# Altium schematic sheet Project_Overview.SchDoc
size A4; Organization: Arribada Initiative; Address1: https://github.com/arribada; Address2: contact@arribada.org; Address3: arribada.org; Address4: UK - Portsmouth; DocumentNumber: 1; SheetNumber: 1; SheetTotal: 3
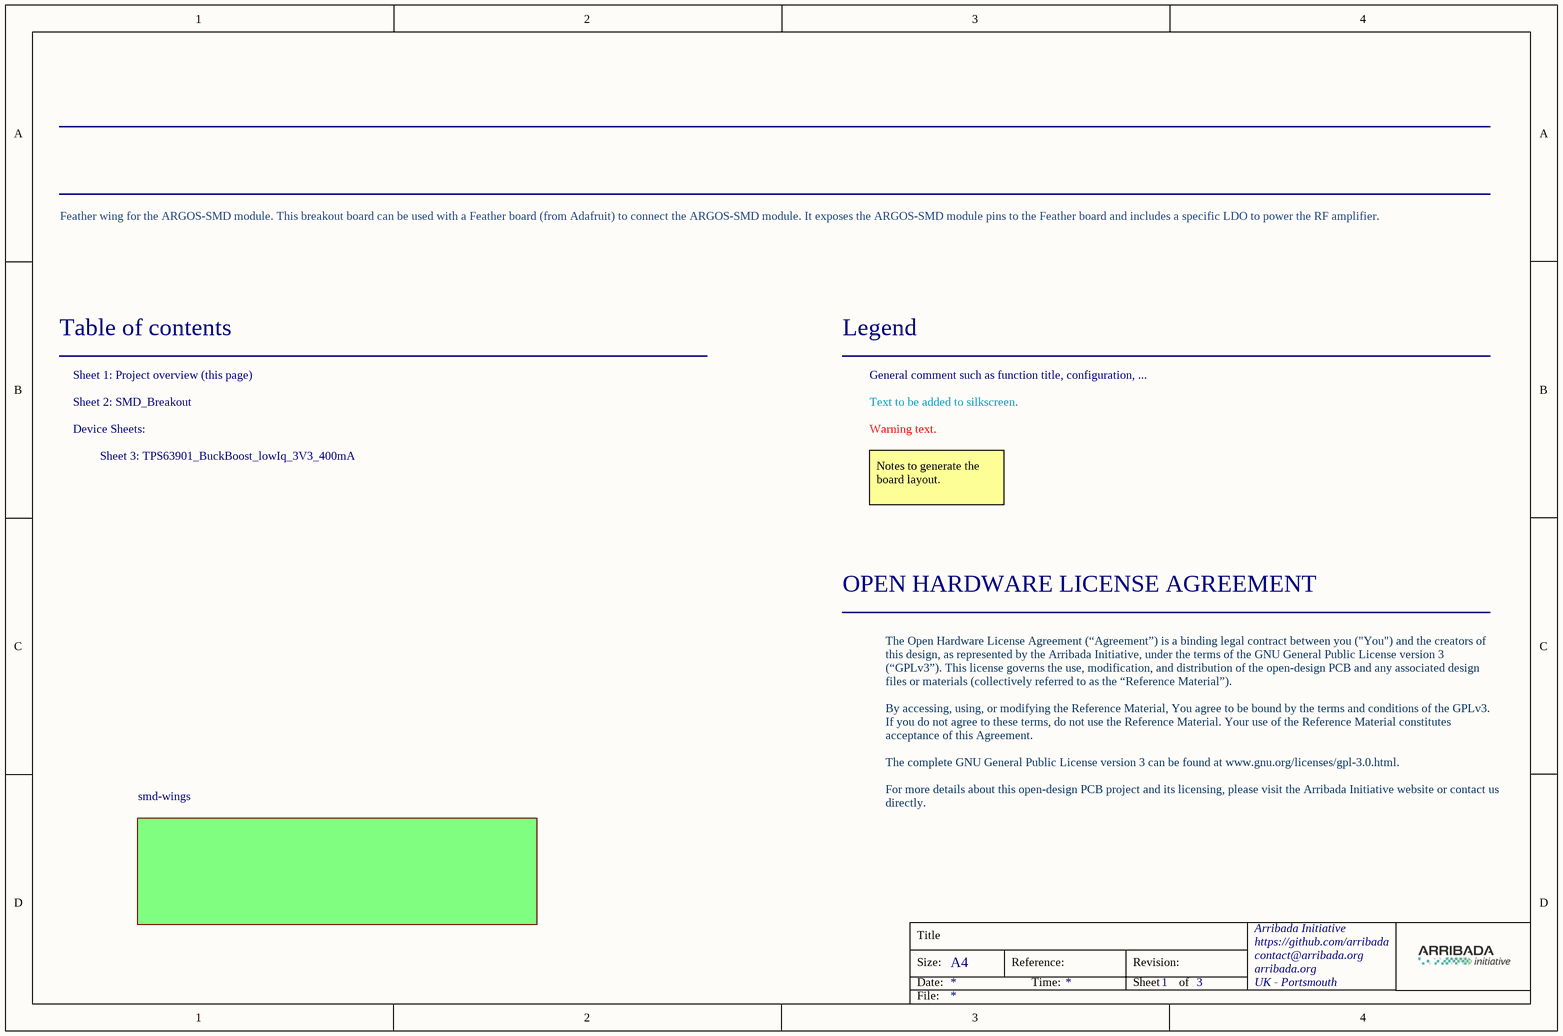
[diagram p0: Project_Overview.SchDoc]

## Sub-sheets
smd-wings = SMD_Breakout.SchDoc: no entries

## Notes on the sheet
- Feather wing for the ARGOS-SMD module. This breakout board can be used with a Feather board (from Adafruit) to connect the ARGOS-SMD module. It exposes the ARGOS-SMD module pins to the Feather board and includes a specific LDO to power the RF amplifier.
- Table of contents
- Sheet 1: Project overview (this page)
- Legend
- General comment such as function title, configuration, ...
- Sheet 2: SMD_Breakout
- Device Sheets:
- Text to be added to silkscreen.
- Warning text.
- Sheet 3: TPS63901_BuckBoost_lowIq_3V3_400mA
- Notes to generate the board layout.
- OPEN HARDWARE LICENSE AGREEMENT
- The Open Hardware License Agreement (“Agreement”) is a binding legal contract between you ("You") and the creators of this design, as represented by the Arribada Initiative, under the terms of the GNU General Public License version 3 (“GPLv3”). This license governs the use, modification, and distribution of the open-design PCB and any associated design files or materials (collectively referred to as the “Reference Material”).
  By accessing, using, or modifying the Reference Material, You agree to be bound by the terms and conditions of the GPLv3. If you do not agree to these terms, do not use the Reference Material. Your use of the Reference Material constitutes acceptance of this Agreement.
  The complete GNU General Public License version 3 can be found at www.gnu.org/licenses/gpl-3.0.html.
  For more details about this open-design PCB project and its licensing, please visit the Arribada Initiative website or contact us directly.
- Title
- Size:
- Date:
- A4
- Reference:
- Time:
- Revision:
- Sheet
- of
- File: